# EAGLE design star (EAGLE 9.6.2)
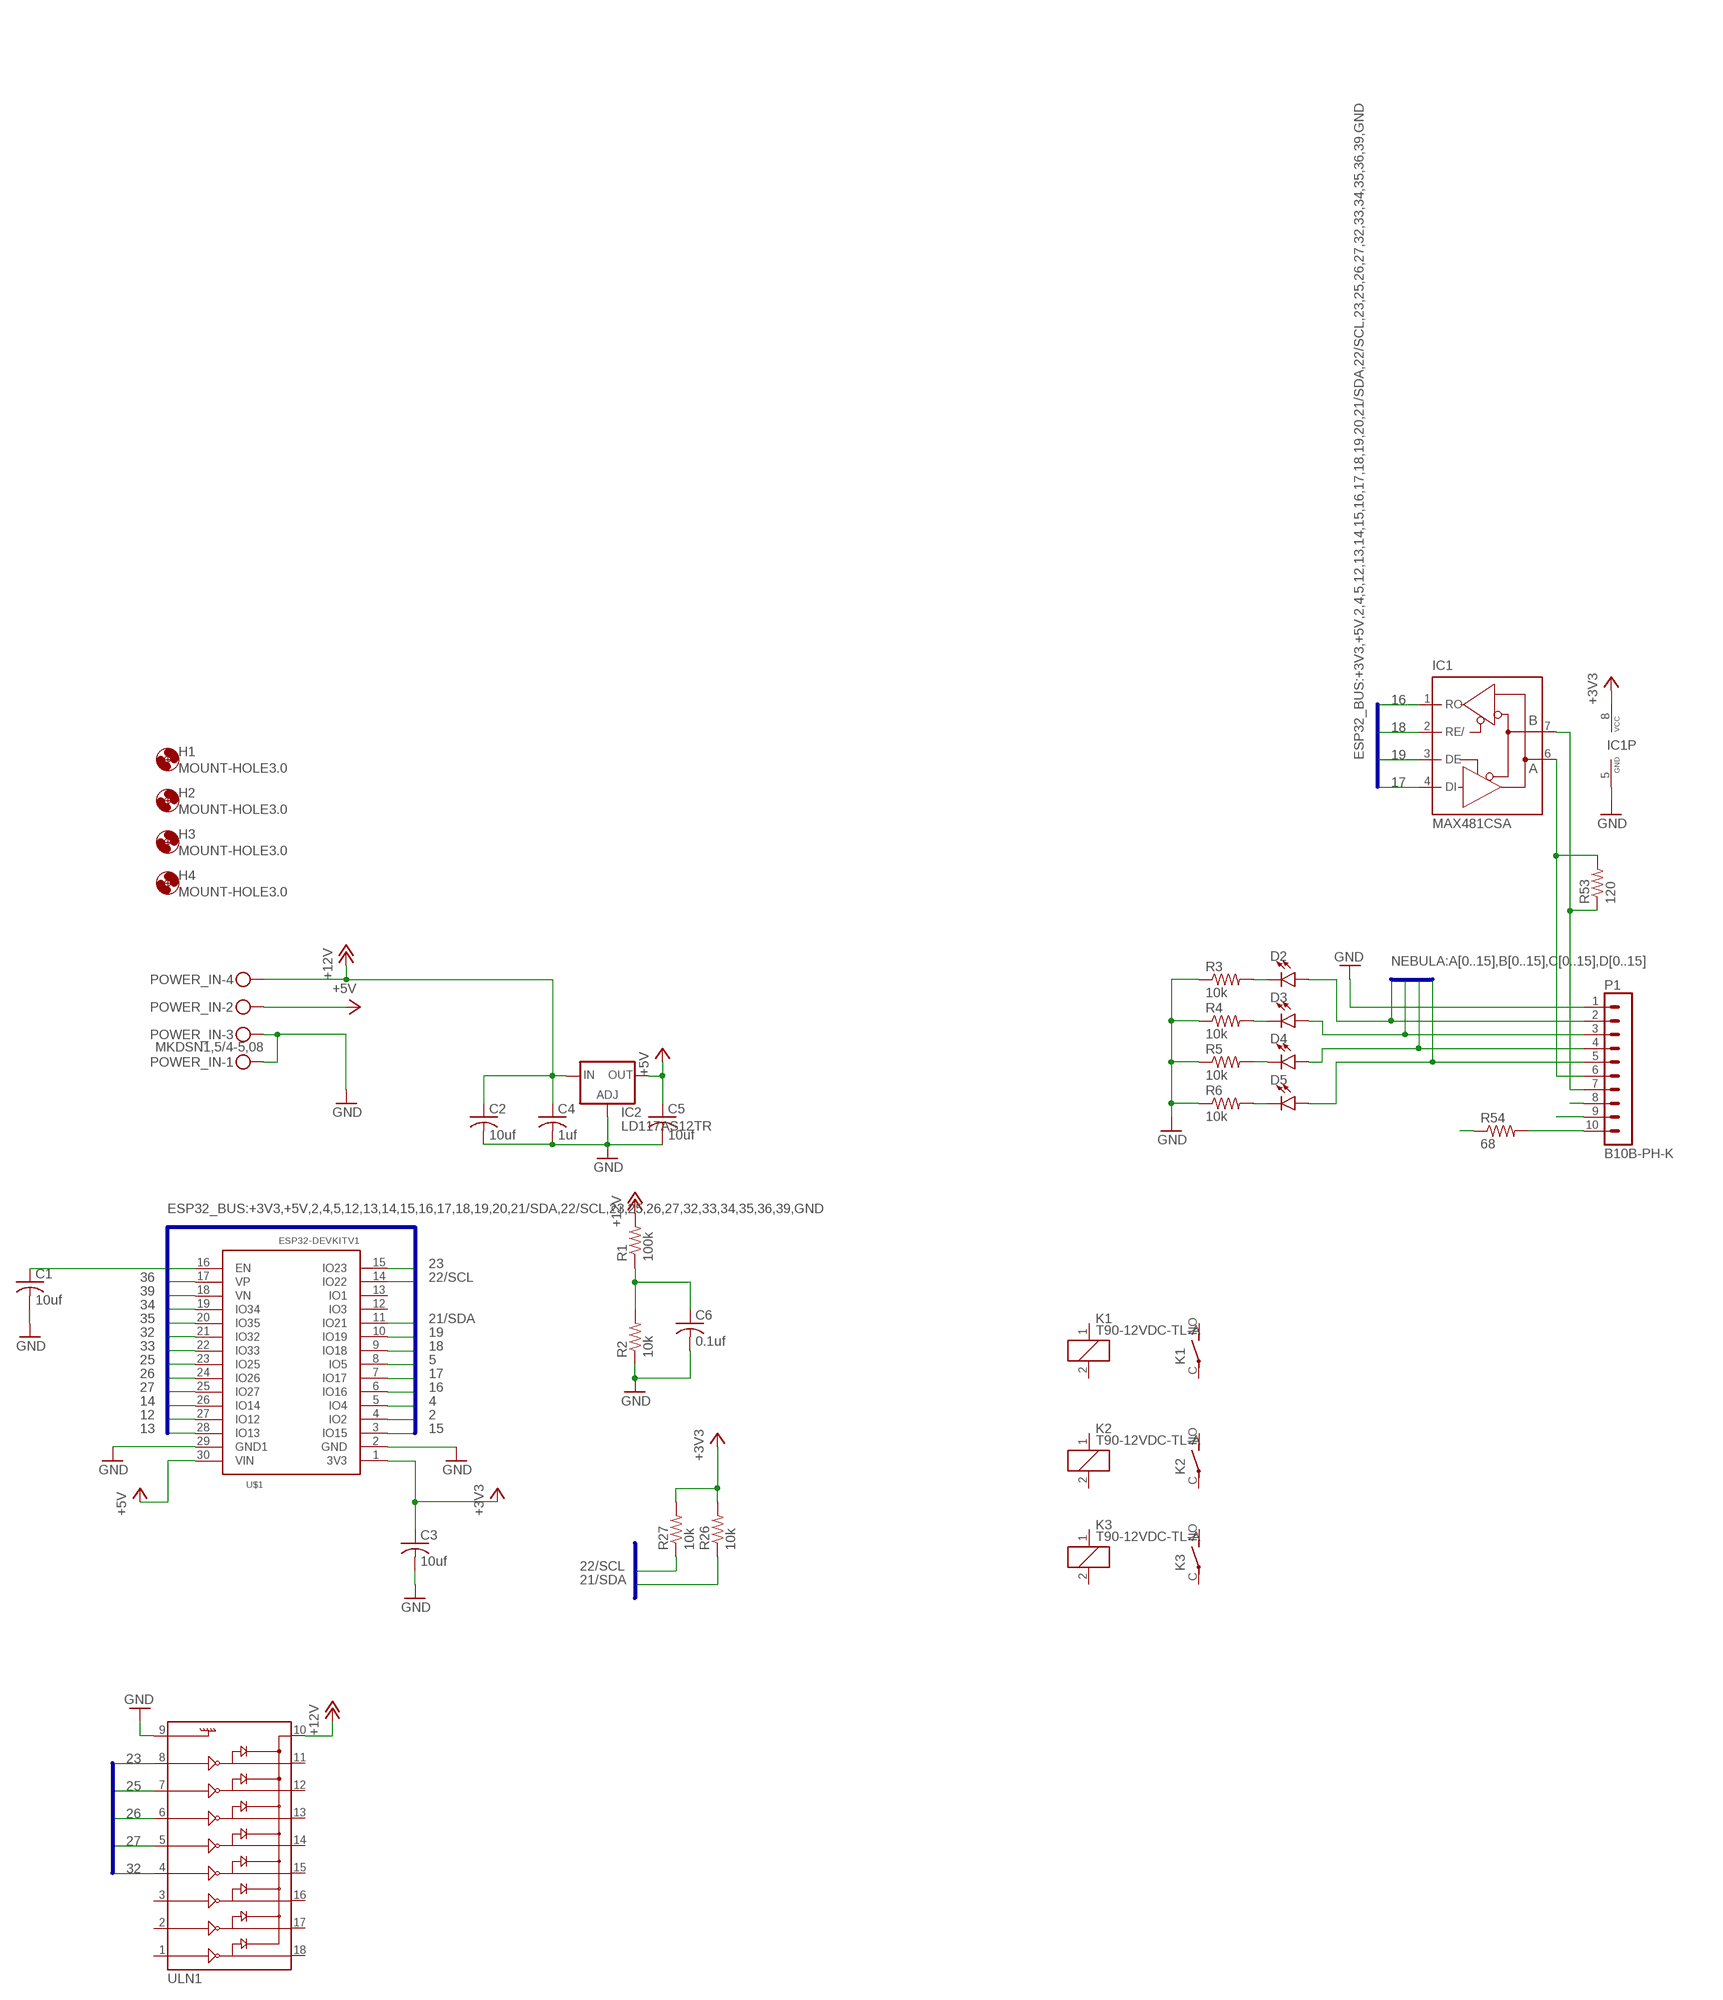
[diagram p0: schematic, sheet 1]

## Parts
C1  10uf  C-USC0603  [C0603]
C2  10uf  C-USC0603  [C0603]
C3  10uf  C-USC0603  [C0603]
C4  1uf  C-USC0805  [C0805]
C5  10uf  C-USC0603  [C0603]
C6  0.1uf  C-USC0603  [C0603]
D2  LED0603  [LED-0603]
D3  LED0603  [LED-0603]
D4  LED0603  [LED-0603]
D5  LED0603  [LED-0603]
H1  MOUNT-HOLE3.0  [3,0]
H2  MOUNT-HOLE3.0  [3,0]
H3  MOUNT-HOLE3.0  [3,0]
H4  MOUNT-HOLE3.0  [3,0]
IC1  MAX481CSA  [SO08]
IC2  LD117AS12TR  [SOT223]
K1  T90-12VDC-TL-A  JT1A-PCB-DC12V  [JT1A-PCB]
K2  T90-12VDC-TL-A  JT1A-PCB-DC12V  [JT1A-PCB]
K3  T90-12VDC-TL-A  JT1A-PCB-DC12V  [JT1A-PCB]
P1  B10B-PH-K  [B10B-PH-K]
POWER_IN  MKDSN1,5/4-5,08  [MKDSN1,5/4-5,08]
R1  100k  R-US_R0603  [R0603]
R2  10k  R-US_R0603  [R0603]
R3  10k  R-US_R0603  [R0603]
R4  10k  R-US_R0603  [R0603]
R5  10k  R-US_R0603  [R0603]
R6  10k  R-US_R0603  [R0603]
R26  10k  R-US_R0603  [R0603]
R27  10k  R-US_R0603  [R0603]
R53  120  R-US_R0603  [R0603]
R54  68  R-US_R0603  [R0603]
U$1  ESP32DEVKITV1  [ESP32-DEVKITV1]
ULN1  ULN2803SOIC  [SO018]

## Nets
2: U$1.4(IO2)
4: U$1.5(IO4)
5: U$1.8(IO5)
12: U$1.27(IO12)
13: U$1.28(IO13)
14: U$1.26(IO14)
15: U$1.3(IO15)
16: IC1.1(RO) U$1.6(IO16)
17: IC1.4(DI) U$1.7(IO17)
18: IC1.2(RE/) U$1.9(IO18)
19: IC1.3(DE) U$1.10(IO19)
21/SDA: R26.1 U$1.11(IO21)
22/SCL: R27.1 U$1.14(IO22)
23: U$1.15(IO23) ULN1.8
25: U$1.23(IO25) ULN1.7
26: U$1.24(IO26) ULN1.6
27: U$1.25(IO27) ULN1.5
32: U$1.21(IO32) ULN1.4
33: U$1.22(IO33)
34: U$1.19(IO34)
35: U$1.20(IO35)
36: U$1.17(VP)
39: C6.1 R1.1 R2.2 U$1.18(VN)
+3V3 [3V3]: C3.1 IC1.8(VCC) R26.2 R27.2 U$1.1(3V3)
+5V [5V]: C5.1 IC2.4(OUT) POWER_IN.2 U$1.30(VIN)
+12V [12V]: C2.1 C4.1 IC2.3(IN) POWER_IN.4 R1.2 ULN1.10
A0: D2.A P1.2
A1: D3.A P1.3
A2: D4.A P1.4
A3: D5.A P1.5
GND [GND]: C1.2 C2.2 C3.2 C4.2 C5.2 C6.2 IC1.5(GND) IC2.1(ADJ) P1.1 POWER_IN.1 POWER_IN.3 R2.1 R3.1 R4.1 R5.1 R6.1 U$1.2(GND) U$1.29(GND1) ULN1.9
N$1: C1.1 U$1.16(EN)
N$2: P1.8
N$3: D2.C R3.2
N$4: D3.C R4.2
N$5: D4.C R5.2
N$6: D5.C R6.2
N$7: P1.9
N$19: P1.10 R54.2
N$33: IC1.6(A) P1.6 R53.2
N$34: IC1.7(B) P1.7 R53.1
N$130 [3V3]: R54.1
Unconnected: K1.1 K1.2 K1.C(P) K1.NO(S) K2.1 K2.2 K2.C(P) K2.NO(S) K3.1 K3.2 K3.C(P) K3.NO(S) U$1.12(IO3) U$1.13(IO1) ULN1.1 ULN1.2 ULN1.3 ULN1.11 ULN1.12 ULN1.13 ULN1.14 ULN1.15 ULN1.16 ULN1.17 ULN1.18

## Buses
ESP32_BUS:+3V3,+5V,2,4,5,12,13,14,15,16,17,18,19,20,21/SDA,22/SCL,23,25,26,27,32,33,34,35,36,39,GND
NEBULA:A[0..15],B[0..15],C[0..15],D[0..15]

## Library data of the parts
C1-C3 C5 = rcl:C-US: CAPACITOR, American symbol; LCSC_PART_NUMBER: C19702; SPICEPREFIX: C
C4 = rcl:C-US: CAPACITOR, American symbol; LCSC_PART_NUMBER: C15849; SPICEPREFIX: C
C6 = rcl:C-US: CAPACITOR, American symbol; LCSC_PART_NUMBER: C14663; SPICEPREFIX: C
D2-D5 = SparkFun-LED:LED: LED (Generic) Standard schematic elements and footprints for 5mm, 3mm, 1206, and 0603 sized LEDs. Generic LEDs with no color specified.
H1-H4 = holes:MOUNT-HOLE: MOUNTING HOLE with drill center marker
IC1 = maxim:MAX481CSA: RS485 TRANSEIVER; MF: MAXIM; MPN: MAX481CSA; OC_FARNELL: unknown; OC_NEWARK: 90C3817
IC2 = v-reg:LD117A?*: Low drop fixed and adjustable positive voltage regulators 1 A Source: http://www.st.com/stonline/products/literature/ds/7194/ld1117axx.pdf; LCSC_PART_NUMBER: C6187; PRICE: 0.5
K1-K3 = relay:JT1A?-*: COMPACT ECONOMICAL 30 AMP. RELAY NAiS Source: http://www.mew-europe.com/.. en_ds_61212_0000.pdf; OC_FARNELL: unknown; OC_NEWARK: unknown
P1 = con-jst-ph:B10B-PH-K: HEADER
POWER_IN = con-phoenix-508:MKDSN1,5/4-5,08: MKDSN 1,5/ 4-5,08 Printklemme Nennstrom: 13,5 A Nennspannung: 250 V Rastermaß: 5,08 mm Polzahl: 4 Anschlussart: Schraubanschluss Montage: Löten Anschlussrichtung Leiter/Platine: 0 ° Artikelnummer: 1729144 Source: http://eshop.phoenixcontact.com .. 1729144.pdf
R1 = rcl:R-US_: RESISTOR, American symbol; LCSC_PART_NUMBER: C25803; SPICEPREFIX: R
R2-R6 R26 R27 R53 R54 = rcl:R-US_: RESISTOR, American symbol; LCSC_PART_NUMBER: C25804; SPICEPREFIX: R
U$1 = ESP32-DEVKITV1:ESP32DEVKITV1
ULN1 = SparkFun-IC-Special-Function:ULN2803: Darlington Driver(IC-07959, low stock) ULN2803 Darlington array. 500mA max per channel, 8-channel package. Spark Fun Electronics SKU : COM-00312

## Net classes
0 default: width 0.254 mm, clearance 0.203 mm
1 GND: width 0.508 mm, clearance 0.203 mm
2 12V: width 1.27 mm, clearance 0.254 mm
3 5V: width 1.27 mm, clearance 0.203 mm
4 3V3: width 0.508 mm, clearance 0.203 mm

## Board
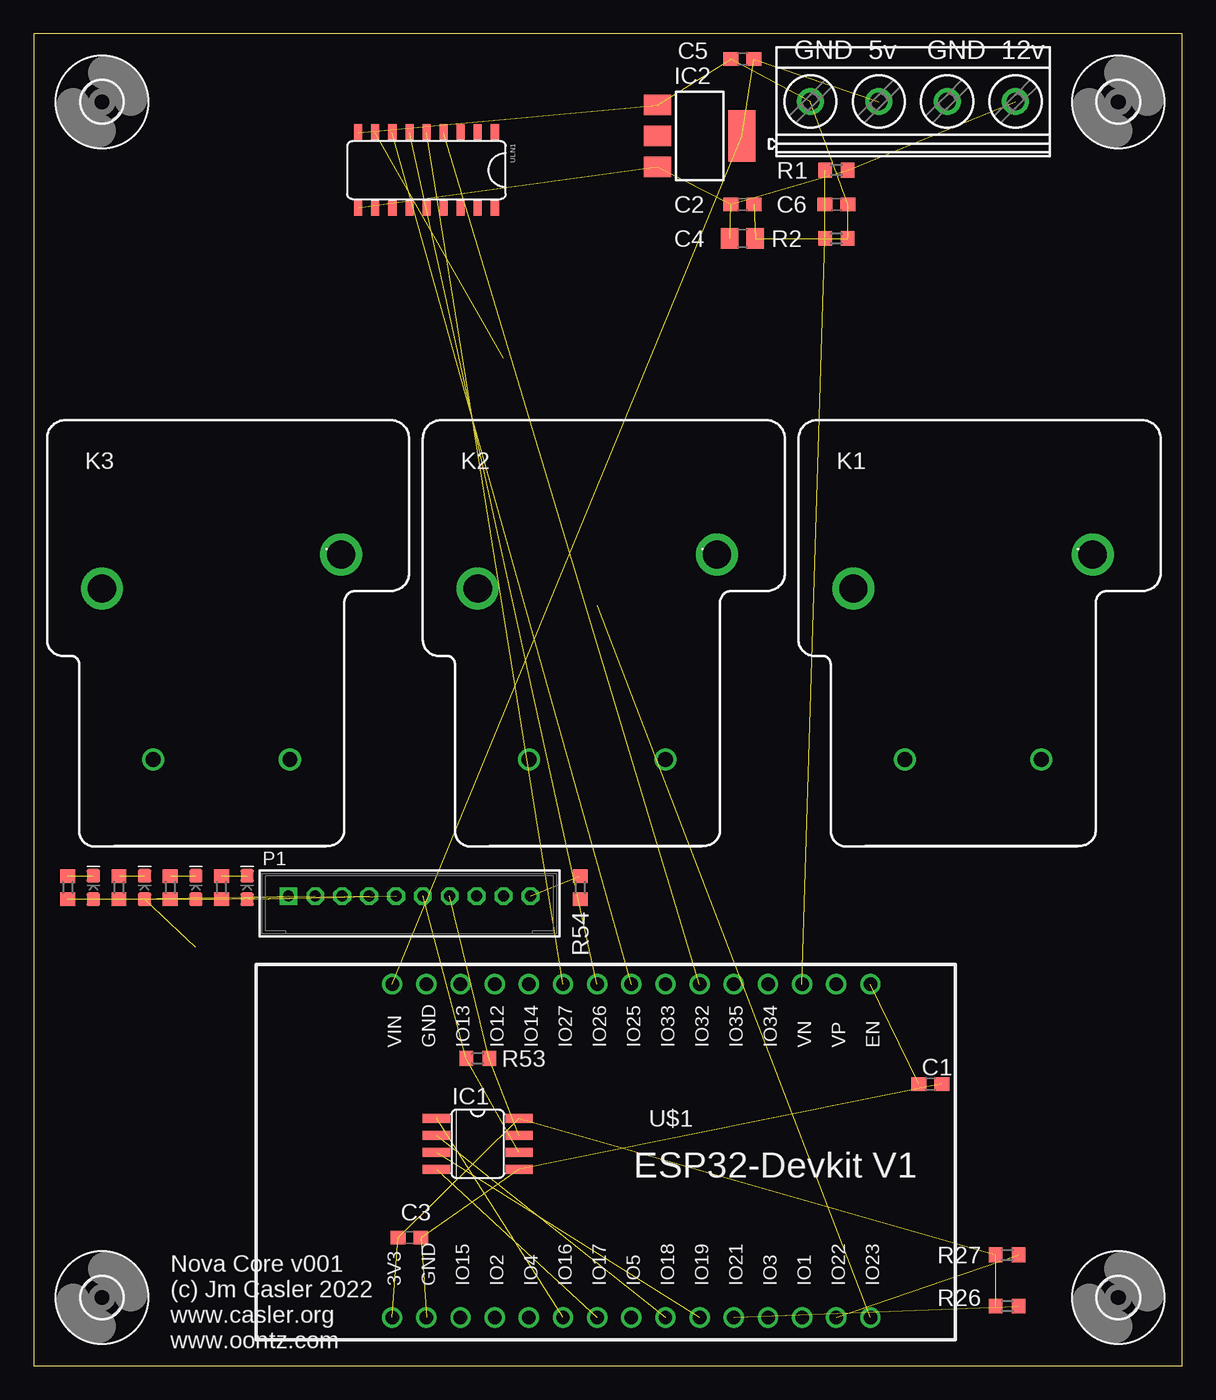
[diagram p1: board, top side]
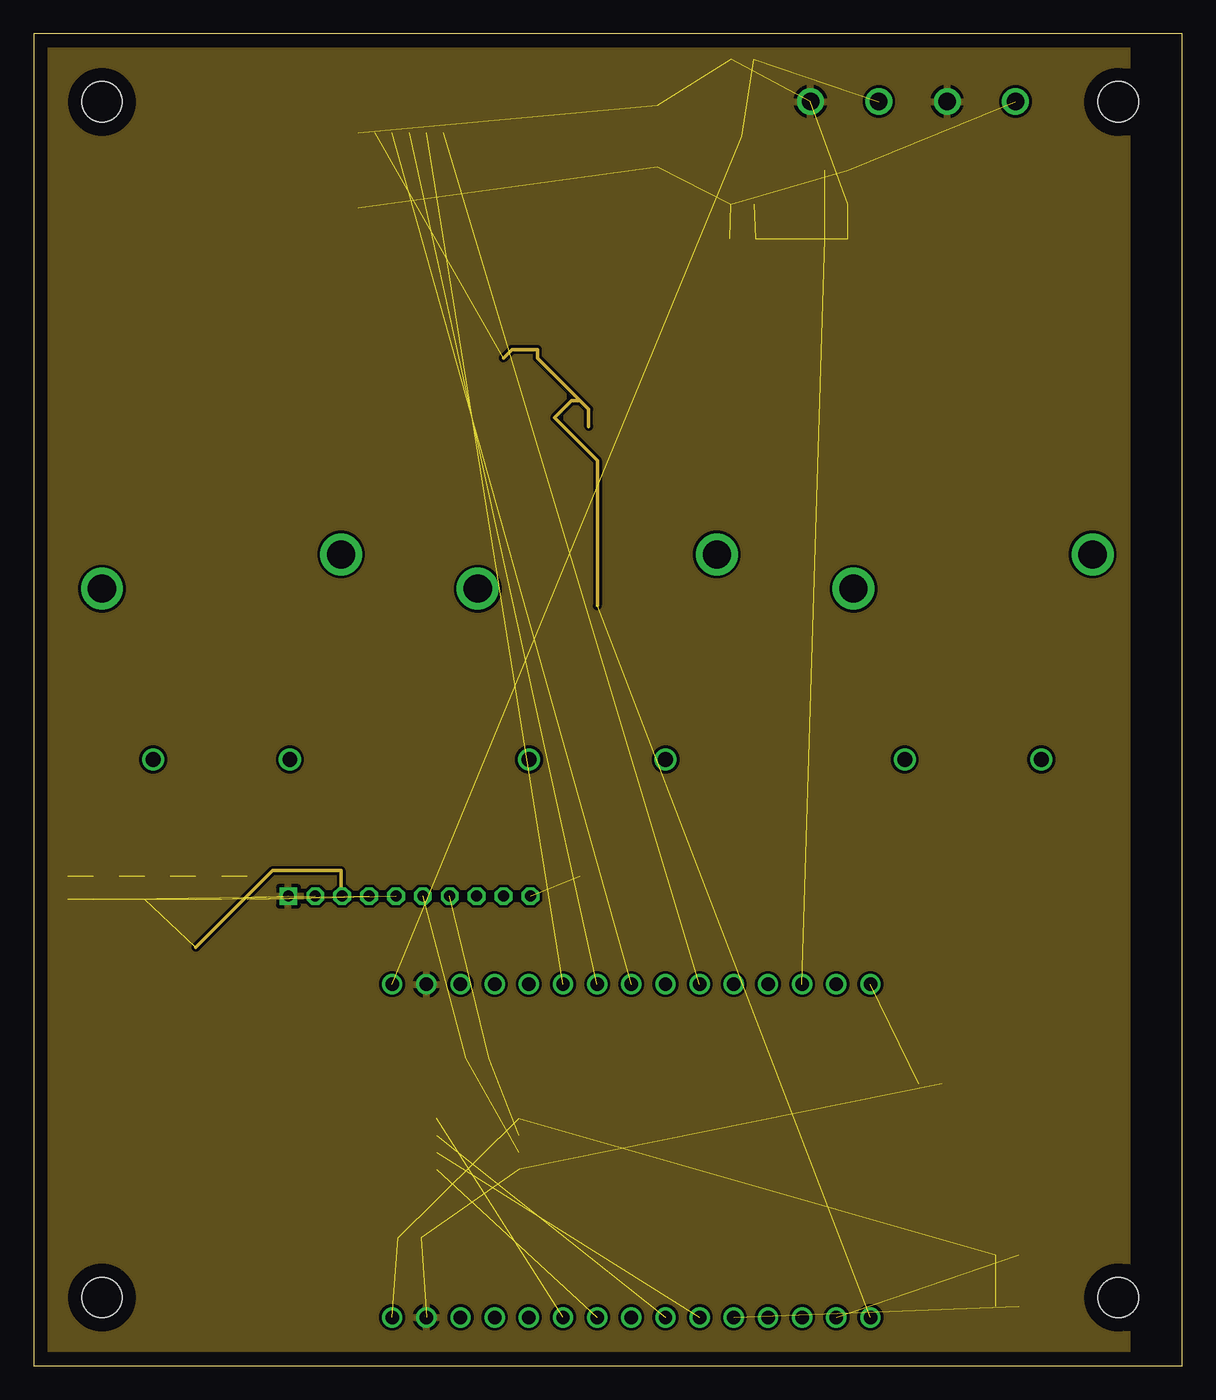
[diagram p2: board, inner layer $GND]

Size 85.39 x 99.05 mm. Coordinates in mm from the lower left corner, seen from the top.
Outline: 0,0 85.39,0 85.39,99.05 0,99.05 0,0
Copper layers (1+2*15+16): Top 0.035mm / dielectric 1.5mm / $GND 0.035mm / dielectric 0.15mm / SIGNAL3 0.035mm / dielectric 0.2mm / Bottom 0.035mm
Design rules "default *": minimum track width 6mil, minimum drill 0.35mm, track to track 6mil, track to pad 6mil, pad to pad 6mil, via to via 6mil, smd to smd 6mil, copper to edge 40mil, drill to drill 6mil, minimum pad ring 10mil, minimum via ring 8mil, stop-mask expansion 4mil, vias tented up to drill 20mil, thermal gap 10mil

### Footprints (pad centres in the part's own frame; a part is rotated, then mirrored left to right if it is on the bottom)
C0603 = smd 1.1 x 1: 1 -0.85,0; 2 0.85,0
C0805 = smd 1.3 x 1.5: 1 -0.95,0; 2 0.95,0
LED-0603 = smd 1 x 1: A -0.877,0; C 0.877,0
3,0 = hole 3: 0,0
SO08 = smd 0.66 x 2.032: 1 -1.905,-3.073; 2 -0.635,-3.073; 3 0.635,-3.073; 4 1.905,-3.073; 5 1.905,3.073; 6 0.635,3.073; 7 -0.635,3.073; 8 -1.905,3.073
SOT223 = smd 1.5 x 2: 1 -2.3,-3.15; 2 0,-3.15; 3 2.3,-3.15 | smd 3.8 x 2: 4 0,3.15
JT1A-PCB = drill 1.1: 1 5.08,0; 2 -5.08,0 | drill 2.1: C -8.89,12.7; NO 8.89,15.24
B10B-PH-K = drill 0.813 square: 1 -9,0 | drill 0.813 octagon: 2 -7,0; 3 -5,0; 4 -3,0; 5 -1,0; 6 1,0; 7 3,0; 8 5,0; 9 7,0; 10 9,0
MKDSN1,5/4-5,08 = drill 1.3 pad 2: 1 -7.641,0.025; 2 -2.561,0.025; 3 2.519,0.025; 4 7.599,0.025
R0603 = smd 1 x 1.1: 1 -0.85,0; 2 0.85,0
ESP32-DEVKITV1 = drill 1 pad 1.422: 1 -22.87,-13.54; 2 -20.33,-13.54; 3 -17.79,-13.54; 4 -15.25,-13.54; 5 -12.71,-13.54; 6 -10.17,-13.54; 7 -7.63,-13.54; 8 -5.09,-13.54; 9 -2.55,-13.54; 10 -0.01,-13.54; 11 2.53,-13.54; 12 5.07,-13.54; 13 7.61,-13.54; 14 10.15,-13.54; 15 12.69,-13.54; 16 12.69,11.23; 17 10.15,11.23; 18 7.61,11.23; 19 5.07,11.23; 20 2.53,11.23; 21 -0.01,11.23; 22 -2.55,11.23; 23 -5.09,11.23; 24 -7.63,11.23; 25 -10.17,11.23; 26 -12.71,11.23; 27 -15.25,11.23; 28 -17.79,11.23; 29 -20.33,11.23; 30 -22.87,11.23
SO018 = smd 0.6 x 1.2: 1 -5.08,-2.8; 2 -3.81,-2.8; 3 -2.54,-2.8; 4 -1.27,-2.8; 5 0,-2.8; 6 1.27,-2.8; 7 2.54,-2.8; 8 3.81,-2.8; 9 5.08,-2.8; 10 5.08,2.8; 11 3.81,2.8; 12 2.54,2.8; 13 1.27,2.8; 14 0,2.8; 15 -1.27,2.8; 16 -2.54,2.8; 17 -3.81,2.8; 18 -5.08,2.8

### Placement (x,y rotation side)
C1  66.67,20.95 0 top
C2  52.7,86.36 0 top
C3  27.94,9.53 0 top
C4  52.7,83.82 0 top
C5  52.7,97.16 180 top
C6  59.69,86.36 0 top
D2  4.45,35.56 90 top
D3  8.26,35.56 90 top
D4  12.06,35.56 90 top
D5  15.88,35.56 90 top
H1  80.64,5.08 0 top
H2  80.64,93.98 0 top
H3  5.08,93.98 0 top
H4  5.08,5.08 0 top
IC1  33.02,16.51 270 top
IC2  49.53,91.44 270 top
K1  69.85,45.09 0 top
K2  41.91,45.09 0 top
K3  13.97,45.09 0 top
P1  27.94,34.92 0 top
POWER_IN  65.41,93.98 0 top
R1  59.69,88.9 0 top
R2  59.69,83.82 180 top
R3  2.54,35.56 90 top
R4  6.35,35.56 90 top
R5  10.16,35.56 90 top
R6  13.97,35.56 90 top
R26  72.39,4.45 180 top
R27  72.39,8.26 180 top
R53  33.02,22.86 180 top
R54  40.64,35.56 90 top
U$1  49.53,17.14 0 top
ULN1  29.21,88.9 180 top

### Tracks (layer width: path | path; a pad name or v marks a point on that pad's centre or on a via)
16  (1 unrouted)
17  (1 unrouted)
18  (1 unrouted)
19  (1 unrouted)
21/SDA  (1 unrouted)
22/SCL  (1 unrouted)
23  (2 unrouted)
  $GND 0.254: 40.64,71.75 41.27,71.12 41.27,69.85 | 40.64,71.75 37.47,74.93 37.47,75.56 35.56,75.56 34.92,74.93 | 40.64,71.75 40.01,71.75 38.73,70.48 41.91,67.31 41.91,56.52
25  (1 unrouted)
26  (1 unrouted)
27  (1 unrouted)
32  (1 unrouted)
39  (3 unrouted)
+3V3  (4 unrouted)
+5V  (3 unrouted)
+12V  (5 unrouted)
A0  (1 unrouted)
A1  (1 unrouted)
  $GND 0.254: 12.06,31.11 17.78,36.83 22.86,36.83 22.86,34.92 P1.3
A2  (1 unrouted)
A3  (1 unrouted)
GND  (14 unrouted)
  pour $GND: -0.64,100.33 80.64,100.33 81.28,99.69 81.28,-1.27 -0.64,-1.27 -1.27,-1.91 -1.27,99.69
N$1  (1 unrouted)
N$3  (1 unrouted)
N$4  (1 unrouted)
N$5  (1 unrouted)
N$6  (1 unrouted)
N$19  (1 unrouted)
N$33  (2 unrouted)
N$34  (2 unrouted)

### Text on the board
tPlace: GND 5v GND 12v
tNames: Nova Core v001 / (c) Jm Casler 2022 / www.casler.org / www.oontz.com
tValues: *